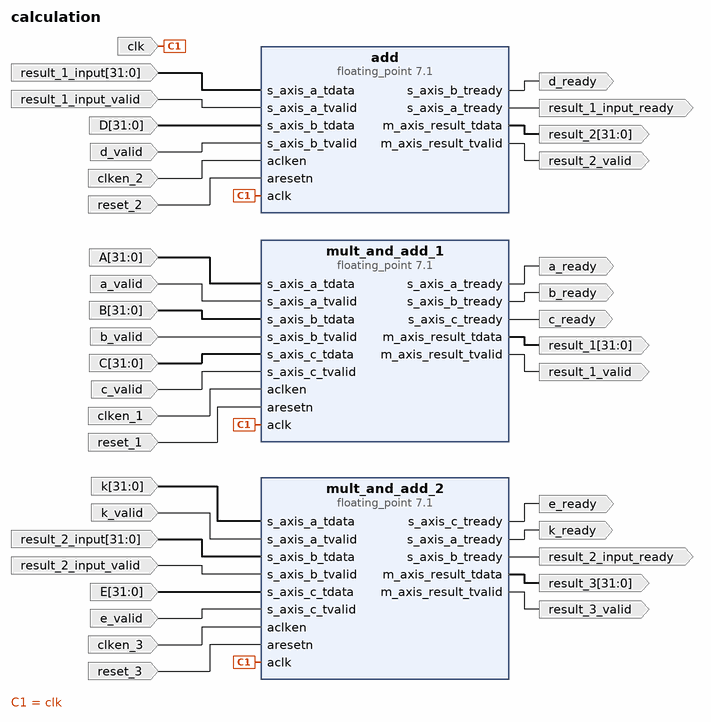
[diagram p0: block diagram of the top level]
# Vivado block design calculation, xc7a100tcsg324-1, Vivado 2018.2
create_bd_design calculation

create_bd_port -dir I -from 31 -to 0 -type data A
create_bd_port -dir I a_valid
create_bd_port -dir I -from 31 -to 0 -type data B
create_bd_port -dir I b_valid
create_bd_port -dir I -from 31 -to 0 -type data C
create_bd_port -dir I c_valid
create_bd_port -dir I -type clk clk
set_property -dict {CONFIG.FREQ_HZ 100000000} [get_bd_ports clk]
create_bd_port -dir I -type ce clken_1
set_property -dict {CONFIG.POLARITY ACTIVE_HIGH} [get_bd_ports clken_1]
create_bd_port -dir I -type rst reset_1
create_bd_port -dir O -from 31 -to 0 -type data result_1
create_bd_port -dir O result_1_valid
create_bd_port -dir I -from 31 -to 0 -type data result_1_input
create_bd_port -dir I result_1_input_valid
create_bd_port -dir I -from 31 -to 0 -type data D
create_bd_port -dir I d_valid
create_bd_port -dir I -type ce clken_2
set_property -dict {CONFIG.POLARITY ACTIVE_HIGH} [get_bd_ports clken_2]
create_bd_port -dir I -type rst reset_2
create_bd_port -dir I -from 31 -to 0 -type data k
create_bd_port -dir I k_valid
create_bd_port -dir I -from 31 -to 0 -type data result_2_input
create_bd_port -dir I result_2_input_valid
create_bd_port -dir I -from 31 -to 0 -type data E
create_bd_port -dir I e_valid
create_bd_port -dir O -from 31 -to 0 -type data result_2
create_bd_port -dir O result_2_valid
create_bd_port -dir O -from 31 -to 0 -type data result_3
create_bd_port -dir O result_3_valid
create_bd_port -dir O a_ready
create_bd_port -dir O b_ready
create_bd_port -dir O c_ready
create_bd_port -dir O result_1_input_ready
create_bd_port -dir O d_ready
create_bd_port -dir O k_ready
create_bd_port -dir O result_2_input_ready
create_bd_port -dir O e_ready
create_bd_port -dir I -type ce clken_3
set_property -dict {CONFIG.POLARITY ACTIVE_HIGH} [get_bd_ports clken_3]
create_bd_port -dir I -type rst reset_3

create_bd_cell -type ip -vlnv xilinx.com:ip:floating_point:7.1 mult_and_add_1
set_property -dict [list \
  CONFIG.Operation_Type FMA \
  CONFIG.Add_Sub_Value Add \
  CONFIG.A_Precision_Type Single \
  CONFIG.C_A_Exponent_Width 8 \
  CONFIG.C_A_Fraction_Width 24 \
  CONFIG.Result_Precision_Type Single \
  CONFIG.C_Result_Exponent_Width 8 \
  CONFIG.C_Result_Fraction_Width 24 \
  CONFIG.C_Mult_Usage Full_Usage \
  CONFIG.Axi_Optimize_Goal Resources \
  CONFIG.Has_RESULT_TREADY false \
  CONFIG.C_Latency 20 \
  CONFIG.C_Rate 1 \
  CONFIG.Has_ACLKEN true \
  CONFIG.Has_ARESETn true \
] [get_bd_cells mult_and_add_1]
create_bd_cell -type ip -vlnv xilinx.com:ip:floating_point:7.1 add
set_property -dict [list \
  CONFIG.Add_Sub_Value Add \
  CONFIG.Axi_Optimize_Goal Resources \
  CONFIG.Has_RESULT_TREADY false \
  CONFIG.C_Latency 12 \
  CONFIG.Has_ACLKEN true \
  CONFIG.Has_ARESETn true \
] [get_bd_cells add]
create_bd_cell -type ip -vlnv xilinx.com:ip:floating_point:7.1 mult_and_add_2
set_property -dict [list \
  CONFIG.Operation_Type FMA \
  CONFIG.Add_Sub_Value Add \
  CONFIG.A_Precision_Type Single \
  CONFIG.C_A_Exponent_Width 8 \
  CONFIG.C_A_Fraction_Width 24 \
  CONFIG.Result_Precision_Type Single \
  CONFIG.C_Result_Exponent_Width 8 \
  CONFIG.C_Result_Fraction_Width 24 \
  CONFIG.C_Mult_Usage Full_Usage \
  CONFIG.Axi_Optimize_Goal Resources \
  CONFIG.Has_RESULT_TREADY false \
  CONFIG.C_Latency 20 \
  CONFIG.C_Rate 1 \
  CONFIG.Has_ACLKEN true \
  CONFIG.Has_ARESETn true \
] [get_bd_cells mult_and_add_2]

# ---- connections ----

connect_bd_net [get_bd_ports A] [get_bd_pins mult_and_add_1/s_axis_a_tdata]
connect_bd_net [get_bd_ports a_valid] [get_bd_pins mult_and_add_1/s_axis_a_tvalid]
connect_bd_net [get_bd_ports B] [get_bd_pins mult_and_add_1/s_axis_b_tdata]
connect_bd_net [get_bd_ports b_valid] [get_bd_pins mult_and_add_1/s_axis_b_tvalid]
connect_bd_net [get_bd_ports C] [get_bd_pins mult_and_add_1/s_axis_c_tdata]
connect_bd_net [get_bd_ports c_valid] [get_bd_pins mult_and_add_1/s_axis_c_tvalid]
connect_bd_net [get_bd_ports clk] [get_bd_pins mult_and_add_1/aclk] [get_bd_pins add/aclk] [get_bd_pins mult_and_add_2/aclk]
connect_bd_net -net clken_1_1 [get_bd_ports clken_1] [get_bd_pins mult_and_add_1/aclken]
connect_bd_net -net reset_1_1 [get_bd_ports reset_1] [get_bd_pins mult_and_add_1/aresetn]
connect_bd_net [get_bd_pins mult_and_add_1/m_axis_result_tdata] [get_bd_ports result_1]
connect_bd_net [get_bd_pins mult_and_add_1/m_axis_result_tvalid] [get_bd_ports result_1_valid]
connect_bd_net [get_bd_ports result_1_input] [get_bd_pins add/s_axis_a_tdata]
connect_bd_net [get_bd_ports result_1_input_valid] [get_bd_pins add/s_axis_a_tvalid]
connect_bd_net [get_bd_ports D] [get_bd_pins add/s_axis_b_tdata]
connect_bd_net [get_bd_ports d_valid] [get_bd_pins add/s_axis_b_tvalid]
connect_bd_net -net clken_2_1 [get_bd_ports clken_2] [get_bd_pins add/aclken]
connect_bd_net -net reset_2_1 [get_bd_ports reset_2] [get_bd_pins add/aresetn]
connect_bd_net [get_bd_ports k] [get_bd_pins mult_and_add_2/s_axis_a_tdata]
connect_bd_net [get_bd_ports k_valid] [get_bd_pins mult_and_add_2/s_axis_a_tvalid]
connect_bd_net [get_bd_ports result_2_input] [get_bd_pins mult_and_add_2/s_axis_b_tdata]
connect_bd_net [get_bd_ports result_2_input_valid] [get_bd_pins mult_and_add_2/s_axis_b_tvalid]
connect_bd_net [get_bd_ports E] [get_bd_pins mult_and_add_2/s_axis_c_tdata]
connect_bd_net [get_bd_ports e_valid] [get_bd_pins mult_and_add_2/s_axis_c_tvalid]
connect_bd_net [get_bd_pins add/m_axis_result_tdata] [get_bd_ports result_2]
connect_bd_net [get_bd_pins add/m_axis_result_tvalid] [get_bd_ports result_2_valid]
connect_bd_net [get_bd_pins mult_and_add_2/m_axis_result_tdata] [get_bd_ports result_3]
connect_bd_net [get_bd_pins mult_and_add_2/m_axis_result_tvalid] [get_bd_ports result_3_valid]
connect_bd_net [get_bd_pins mult_and_add_1/s_axis_a_tready] [get_bd_ports a_ready]
connect_bd_net [get_bd_pins mult_and_add_1/s_axis_b_tready] [get_bd_ports b_ready]
connect_bd_net [get_bd_pins mult_and_add_1/s_axis_c_tready] [get_bd_ports c_ready]
connect_bd_net [get_bd_pins add/s_axis_a_tready] [get_bd_ports result_1_input_ready]
connect_bd_net [get_bd_pins add/s_axis_b_tready] [get_bd_ports d_ready]
connect_bd_net [get_bd_pins mult_and_add_2/s_axis_a_tready] [get_bd_ports k_ready]
connect_bd_net [get_bd_pins mult_and_add_2/s_axis_b_tready] [get_bd_ports result_2_input_ready]
connect_bd_net [get_bd_pins mult_and_add_2/s_axis_c_tready] [get_bd_ports e_ready]
connect_bd_net -net clken_3_1 [get_bd_ports clken_3] [get_bd_pins mult_and_add_2/aclken]
connect_bd_net -net reset_3_1 [get_bd_ports reset_3] [get_bd_pins mult_and_add_2/aresetn]

validate_bd_design
save_bd_design
